# EAGLE schematic PC_PIC (EAGLE 7.7.0)
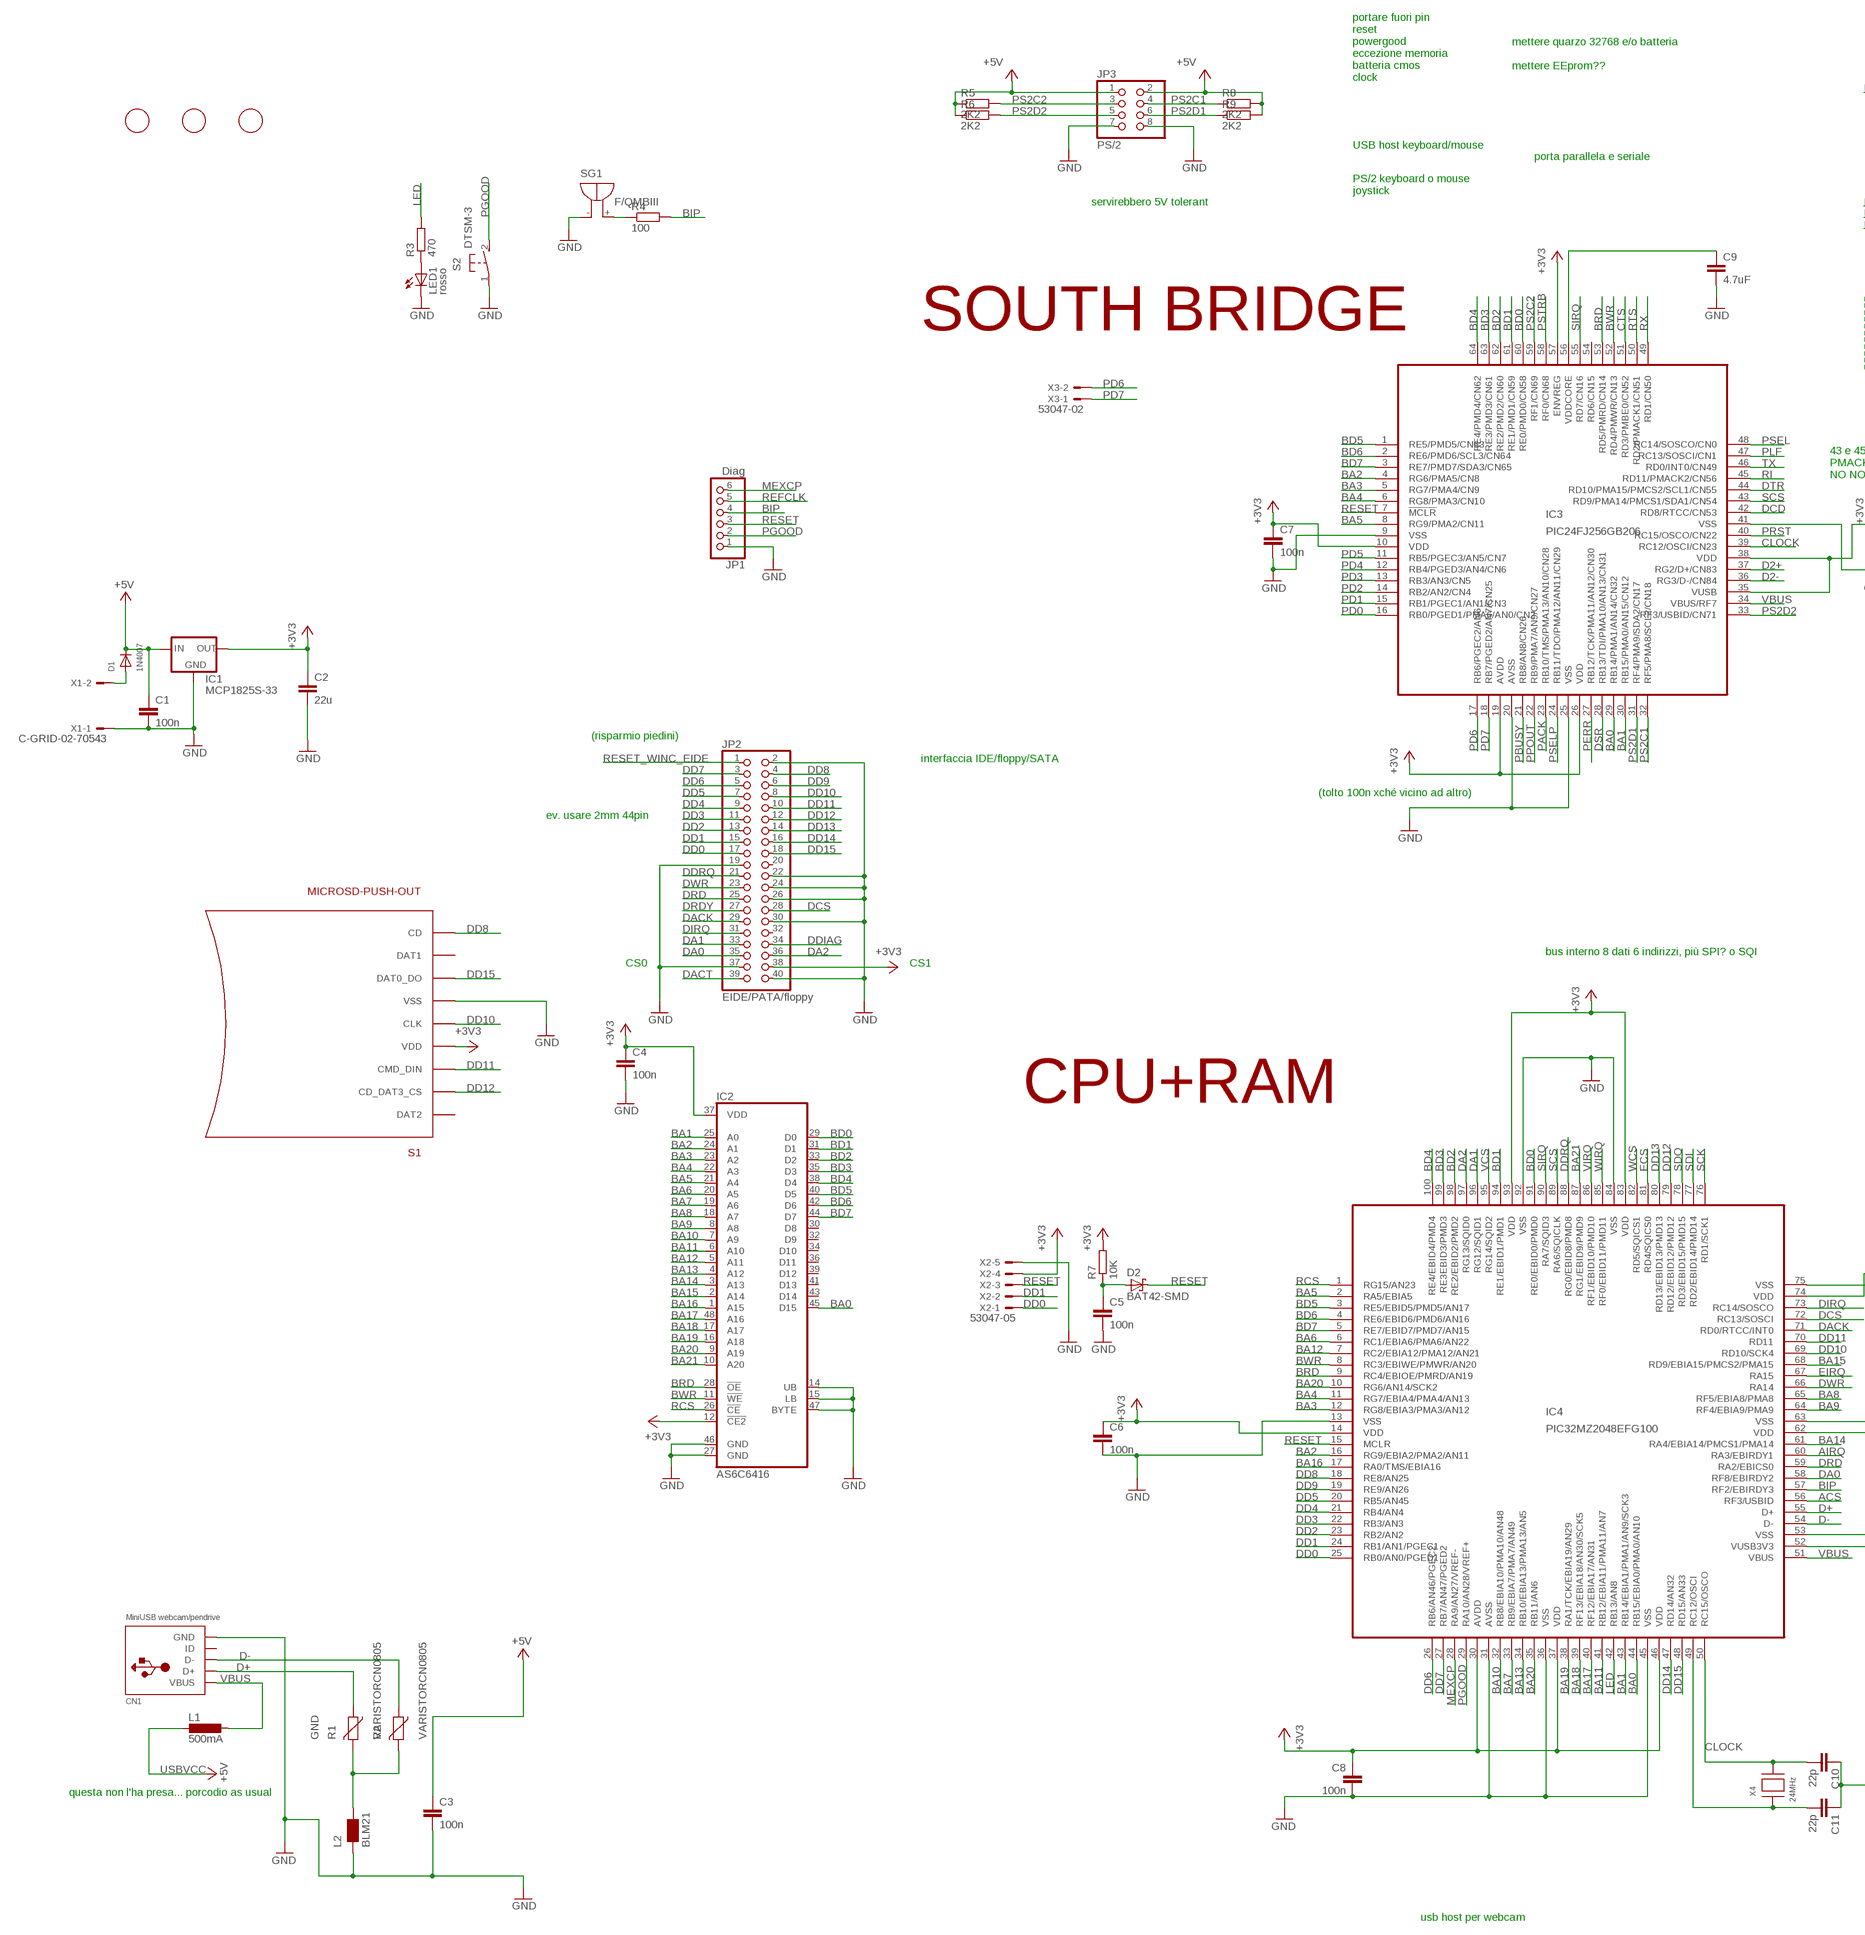
[diagram p0: schematic, sheet 1, part 1 of 3]
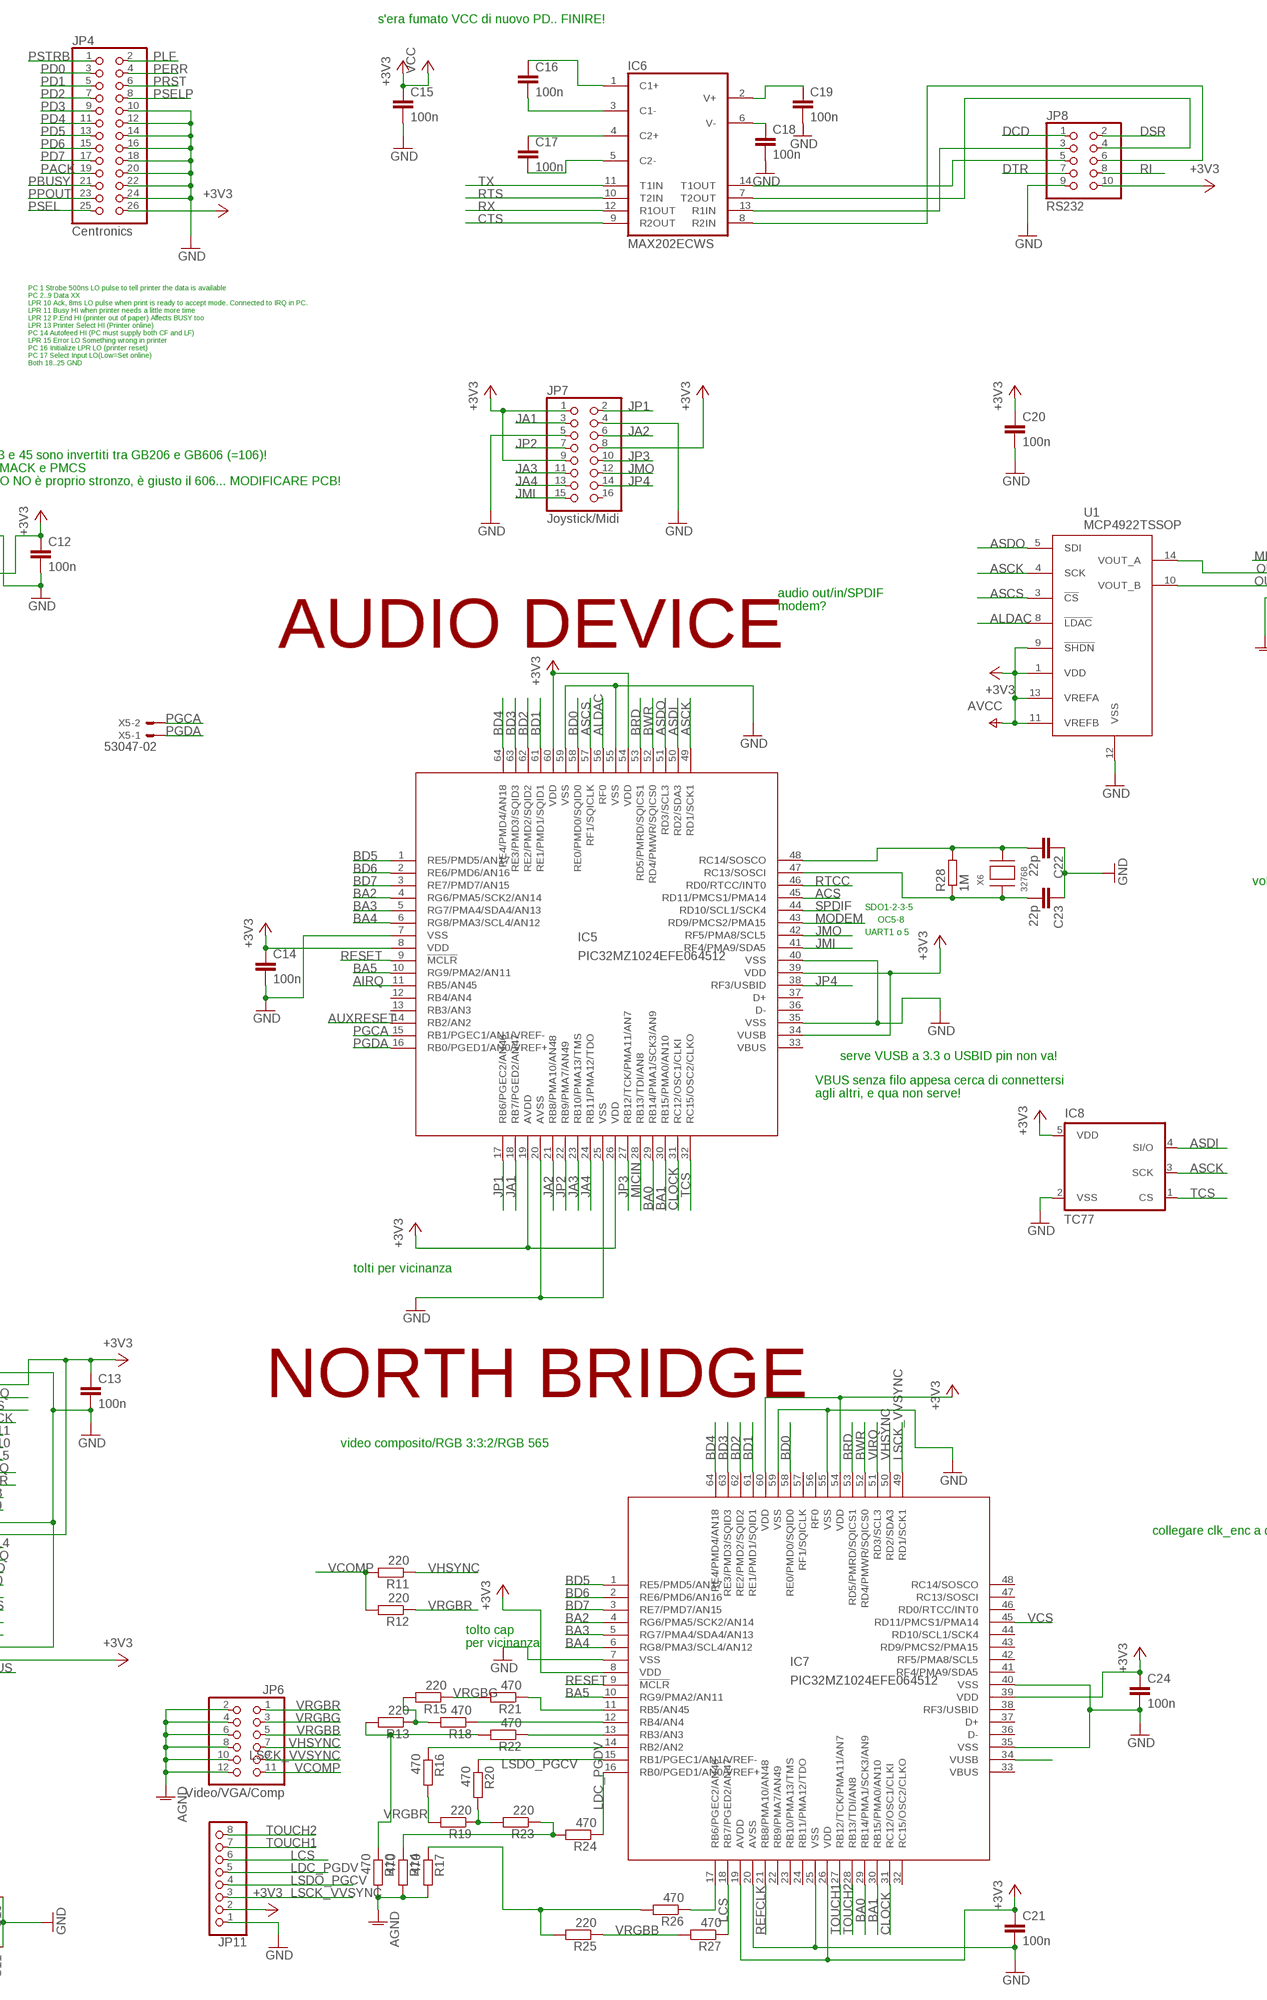
[diagram p1: schematic, sheet 1, part 2 of 3]
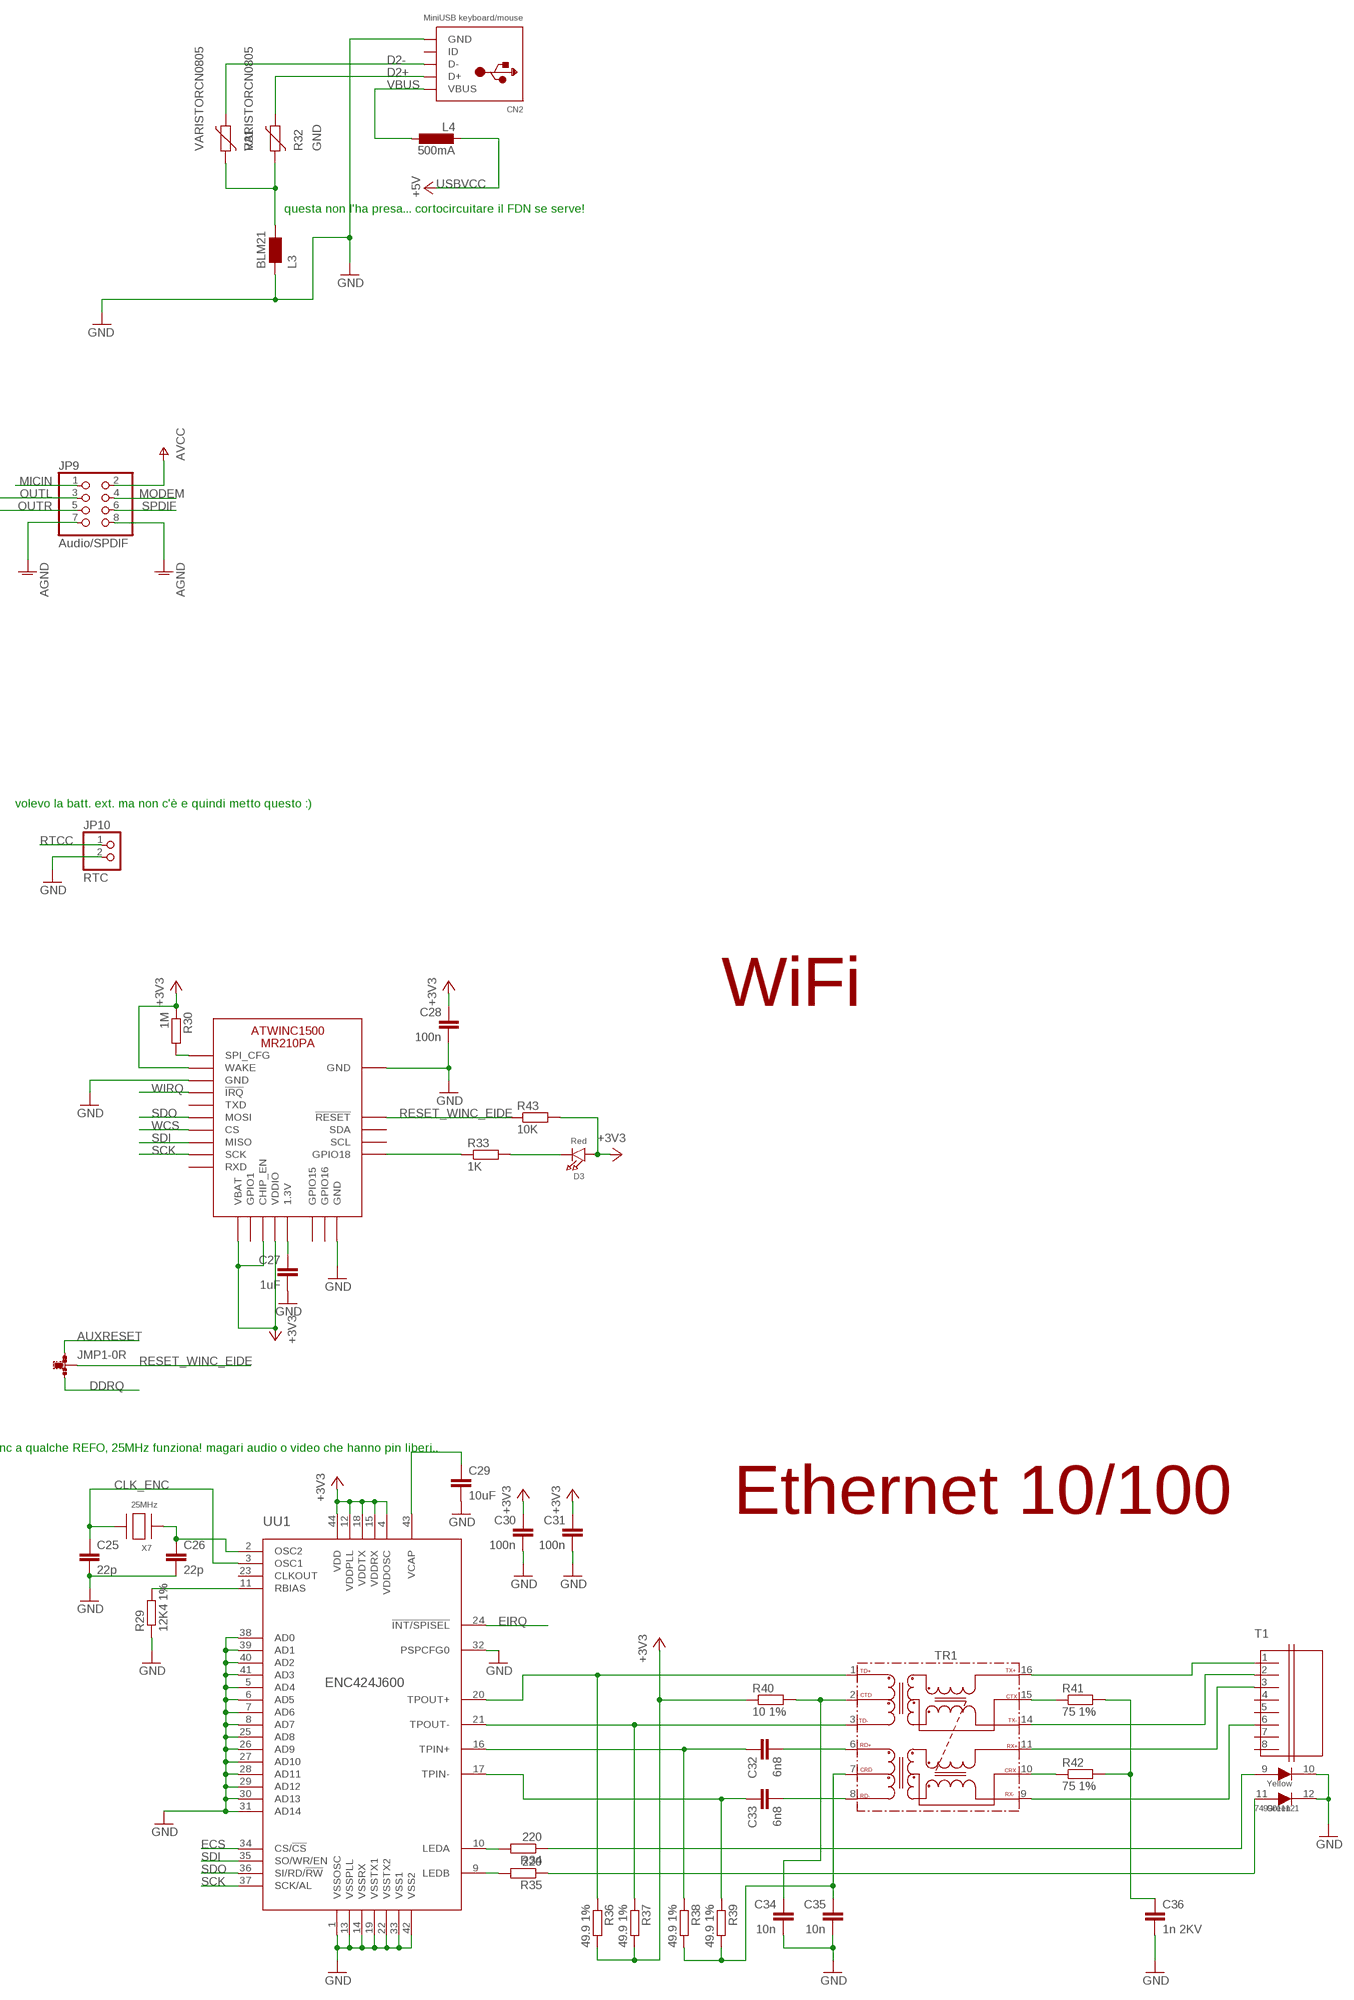
[diagram p2: schematic, sheet 1, part 3 of 3]

## Parts
C1  100n  C-EUC0805  [C0805]
C2  22u  C-EUC1206  [C1206]
C3  100n  C-EUC0805  [C0805]
C4  100n  C-EUC0805  [C0805]
C5  100n  C-EUC0805  [C0805]
C6  100n  C-EUC0805  [C0805]
C7  100n  C-EUC0805  [C0805]
C8  100n  C-EUC0805  [C0805]
C9  4.7uF  C-EUC1206  [C1206]
C10  22p  C-EUC0805  [C0805]
C11  22p  C-EUC0805  [C0805]
C12  100n  C-EUC0805  [C0805]
C13  100n  C-EUC0805  [C0805]
C14  100n  C-EUC0805  [C0805]
C15  100n  C-EUC0805  [C0805]
C16  100n  C-EUC0805  [C0805]
C17  100n  C-EUC0805  [C0805]
C18  100n  C-EUC0805  [C0805]
C19  100n  C-EUC0805  [C0805]
C20  100n  C-EUC0805  [C0805]
C21  100n  C-EUC0805  [C0805]
C22  22p  C-EUC0805  [C0805]
C23  22p  C-EUC0805  [C0805]
C24  100n  C-EUC0805  [C0805]
C25  22p  C-EUC0805  [C0805]
C26  22p  C-EUC0805  [C0805]
C27  1uF  C-EUC0805  [C0805]
C28  100n  C-EUC0805  [C0805]
C29  10uF  C-EUC1206  [C1206]
C30  100n  C-EUC0805  [C0805]
C31  100n  C-EUC0805  [C0805]
C32  6n8  C-EUC0805  [C0805]
C33  6n8  C-EUC0805  [C0805]
C34  10n  C-EUC0805  [C0805]
C35  10n  C-EUC0805  [C0805]
C36  1n 2KV  C-EUC1206  [C1206]
CN1  MiniUSB webcam/pendrive  USBMINIB  [USB-MINIB]
CN2  MiniUSB keyboard/mouse  USBMINIB  [USB-MINIB]
D1  1N4007  DIODESMA  [SMADIODE]
D2  BAT42-SMD  [DO214AC]
D3  Red  LED0805_NOOUTLINE  [CHIPLED_0805_NOOUTLINE]
F1  FIDUCIAL  [FIDUCIAL_1MM]
F2  FIDUCIAL  [FIDUCIAL_1MM]
F3  FIDUCIAL  [FIDUCIAL_1MM]
IC1  MCP1825S-33  MCP1825SSOT223  [SOT223]
IC2  AS6C6416  [TSOP48]
IC3  PIC24FJ256GB206  [TQFP64-10X10]
IC4  PIC32MZ2048EFG100  [TQFP100-14X14]
IC5  PIC32MZ1024EFE064512  [TQFP64-10X10]
IC6  MAX202ECWS  [SO16]
IC7  PIC32MZ1024EFE064512  [TQFP64-10X10]
IC8  TC77  [SOT23-5L]
JMP1  0R-JUMPC  [C0R-JMP]
JP1  Diag  PINHD-1X06_2.54  [1X06]
JP2  EIDE/PATA/floppy  PINHD-2X20_2.54  [2X20]
JP3  PS/2  PINHD-2X04_2.54  [2X04]
JP4  Centronics  PINHD-2X13_2.54  [2X13]
JP6  Video/VGA/Comp  PINHD-2X06_2.54  [2X06]
JP7  Joystick/Midi  PINHD-2X08_2.54  [2X08]
JP8  RS232  PINHD-2X05_2.54  [2X05]
JP9  Audio/SPDIF  PINHD-2X04_2.54  [2X04]
JP10  RTC  PINHD-1X02_2.54  [1X02]
JP11  PINHD-1X08_2.54  [1X08]
L1  500mA  L-EUL1812  [L1812]
L2  BLM21  WE-CBF_0805  [0805]
L3  BLM21  WE-CBF_0805  [0805]
L4  500mA  L-EUL1812  [L1812]
LED1  rosso  LEDCHIPLED_0805  [CHIPLED_0805]
R1  VARISTORCN0805  [CT/CN0805]
R2  VARISTORCN0805  [CT/CN0805]
R3  470  R-EU_R0805  [R0805]
R4  100  R-EU_R0805  [R0805]
R5  2K2  R-EU_R0805  [R0805]
R6  2K2  R-EU_R0805  [R0805]
R7  10K  R-EU_R0805  [R0805]
R8  2K2  R-EU_R0805  [R0805]
R9  2K2  R-EU_R0805  [R0805]
R10  470  R-EU_R0805  [R0805]
R11  220  R-EU_R0805  [R0805]
R12  220  R-EU_R0805  [R0805]
R13  220  R-EU_R0805  [R0805]
R14  470  R-EU_R0805  [R0805]
R15  220  R-EU_R0805  [R0805]
R16  470  R-EU_R0805  [R0805]
R17  470  R-EU_R0805  [R0805]
R18  470  R-EU_R0805  [R0805]
R19  220  R-EU_R0805  [R0805]
R20  470  R-EU_R0805  [R0805]
R21  470  R-EU_R0805  [R0805]
R22  470  R-EU_R0805  [R0805]
R23  220  R-EU_R0805  [R0805]
R24  470  R-EU_R0805  [R0805]
R25  220  R-EU_R0805  [R0805]
R26  470  R-EU_R0805  [R0805]
R27  470  R-EU_R0805  [R0805]
R28  1M  R-EU_R0805  [R0805]
R29  12K4 1%  R-EU_R0805  [R0805]
R30  1M  R-EU_R0805  [R0805]
R31  VARISTORCN0805  [CT/CN0805]
R32  VARISTORCN0805  [CT/CN0805]
R33  1K  R-EU_R0805  [R0805]
R34  220  R-EU_R0805  [R0805]
R35  220  R-EU_R0805  [R0805]
R36  49.9 1%  R-EU_R0805  [R0805]
R37  49.9 1%  R-EU_R0805  [R0805]
R38  49.9 1%  R-EU_R0805  [R0805]
R39  49.9 1%  R-EU_R0805  [R0805]
R40  10 1%  R-EU_R0805  [R0805]
R41  75 1%  R-EU_R0805  [R0805]
R42  75 1%  R-EU_R0805  [R0805]
R43  10K  R-EU_R0805  [R0805]
S1  MICROSD-PUSH-OUT  [MICROSD-PUSH-OUT]
S2  DTSM-3  [DTSM-3]
SG1  F/QMBIII  [F/QMBIII]
T1  7499011121  [01LAN_RJ45_10/00_Y-G_STD]
TR1  WE-LAN-10/100-BASE-T,POE,749013011  [749013011]
U1  MCP4922TSSOP  [TSSOP14]
UU1  ENC424J600  [TQFP-44]
X1  C-GRID-02-70543  [70543-02]
X2  53047-05  [53047-05]
X3  53047-02  [53047-02]
X4  24MHz  XTALNX5032  [NX5032]
X5  53047-02  [53047-02]
X6  32768  XTAL-3.2X1.5  [XTAL3215]
X7  25MHz  XTALNX5032  [NX5032]
X8  ATWINC1500_MR210PB  ATWINC1500_MR210PA  [ATWINC1500_MR210PA]

## Nets
+3V3 [+3V3]: C2.1 C4.1 C6.1 C7.1 C8.1 C12.1 C13.1 C14.1 C15.1 C20.1 C21.1 C24.1 C28.1 C30.1 C31.1 D3.A IC1.3(OUT) IC2.12(!CE2) IC2.37(VDD) IC3.10(VDD) IC3.19(AVDD) IC3.26(VDD) IC3.35(VUSB) IC3.38(VDD) IC3.57(ENVREG) IC4.14(VDD) IC4.30(AVDD) IC4.37(VDD) IC4.46(VDD) IC4.52(VUSB3V3) IC4.62(VDD) IC4.74(VDD) IC4.83(VDD) IC4.93(VDD) IC5.8(VDD) IC5.19(AVDD) IC5.26(VDD) IC5.34(VUSB) IC5.39(VDD) IC5.54(VDD) IC5.60(VDD) IC7.8(VDD) IC7.19(AVDD) IC7.26(VDD) IC7.39(VDD) IC7.54(VDD) IC7.60(VDD) IC8.5(VDD) JP2.38 JP4.26 JP7.1 JP7.8 JP7.9 JP8.10 JP9.2 JP11.2 R7.2 R30.1 R36.2 R37.2 R40.1 R43.2 S1.4(VDD) U1.1(VDD) U1.9(!SHDN) U1.11(VREFB) U1.13(VREFA) UU1.4(VDDOSC) UU1.12(VDDPLL) UU1.15(VDDRX) UU1.18(VDDTX) UU1.44(VDD) X2.4 X8.J11(WAKE) X8.J20(VBAT) X8.J22(CHIP_EN) X8.J23(VDDIO) ; supply symbol labelled AVCC
+5V [+5V]: C1.1 C3.1 D1.C IC1.1(IN) JP3.1 JP3.2 R5.1 R6.1 R8.2 R9.2
ACS: IC4.56(RF3/USBID) IC5.45(RD11/PMCS1/PMA14)
AIRQ: IC4.60(RA3/EBIRDY1) IC5.11(RB5/AN45)
ALDAC: IC5.56(RF0) U1.8(!LDAC)
ASCK: IC5.49(RD1/SCK1) IC8.3(SCK) U1.4(SCK)
ASCS: IC5.57(RF1/SQICLK) U1.3(!CS)
ASDI: IC5.50(RD2/SDA3) IC8.4(SI/O)
ASDO: IC5.51(RD3/SCL3) U1.5(SDI)
AUXRESET: IC5.14(RB2/AN2) JMP1.1
BA0: IC2.45(D15) IC3.29(RB14/PMA1/AN14/CN32) IC4.44(RB15/EBIA0/PMA0/AN10) IC5.29(RB14/PMA1/SCK3/AN9) IC7.29(RB14/PMA1/SCK3/AN9)
BA1: IC2.25(A0) IC3.30(RB15/PMA0/AN15/CN12) IC4.43(RB14/EBIA1/PMA1/AN9/SCK3) IC5.30(RB15/PMA0/AN10) IC7.30(RB15/PMA0/AN10)
BA2: IC2.24(A1) IC3.4(RG6/PMA5/CN8) IC4.16(RG9/EBIA2/PMA2/AN11) IC5.4(RG6/PMA5/SCK2/AN14) IC7.4(RG6/PMA5/SCK2/AN14)
BA3: IC2.23(A2) IC3.5(RG7/PMA4/CN9) IC4.12(RG8/EBIA3/PMA3/AN12) IC5.5(RG7/PMA4/SDA4/AN13) IC7.5(RG7/PMA4/SDA4/AN13)
BA4: IC2.22(A3) IC3.6(RG8/PMA3/CN10) IC4.11(RG7/EBIA4/PMA4/AN13) IC5.6(RG8/PMA3/SCL4/AN12) IC7.6(RG8/PMA3/SCL4/AN12)
BA5: IC2.21(A4) IC3.8(RG9/PMA2/CN11) IC4.2(RA5/EBIA5) IC5.10(RG9/PMA2/AN11) IC7.10(RG9/PMA2/AN11)
BA6: IC2.20(A5) IC4.6(RC1/EBIA6/PMA6/AN22)
BA7: IC2.19(A6) IC4.33(RB9/EBIA7/PMA7/AN49)
BA8: IC2.18(A7) IC4.65(RF5/EBIA8/PMA8)
BA9: IC2.8(A8) IC4.64(RF4/EBIA9/PMA9)
BA10: IC2.7(A9) IC4.32(RB8/EBIA10/PMA10/AN48)
BA11: IC2.6(A10) IC4.41(RB12/EBIA11/PMA11/AN7)
BA12: IC2.5(A11) IC4.7(RC2/EBIA12/PMA12/AN21)
BA13: IC2.4(A12) IC4.34(RB10/EBIA13/PMA13/AN5)
BA14: IC2.3(A13) IC4.61(RA4/EBIA14/PMCS1/PMA14)
BA15: IC2.2(A14) IC4.68(RD9/EBIA15/PMCS2/PMA15)
BA16: IC2.1(A15) IC4.17(RA0/TMS/EBIA16)
BA17: IC2.48(A16) IC4.40(RF12/EBIA17/AN31)
BA18: IC2.17(A17) IC4.39(RF13/EBIA18/AN30/SCK5)
BA19: IC2.16(A18) IC4.38(RA1/TCK/EBIA19/AN29)
BA20: IC2.9(A19) IC4.10(RG6/AN14/SCK2) IC4.35(RB11/AN6)
BA21: IC2.10(A20) IC4.87(RG1/EBID9/PMD9)
BD0: IC2.29(D0) IC3.60(RE0/PMD0/CN58) IC4.91(RE0/EBID0/PMD0) IC5.58(RE0/PMD0/SQID0) IC7.58(RE0/PMD0/SQID0)
BD1: IC2.31(D1) IC3.61(RE1/PMD1/CN59) IC4.94(RE1/EBID1/PMD1) IC5.61(RE1/PMD1/SQID1) IC7.61(RE1/PMD1/SQID1)
BD2: IC2.33(D2) IC3.62(RE2/PMD2/CN60) IC4.98(RE2/EBID2/PMD2) IC5.62(RE2/PMD2/SQID2) IC7.62(RE2/PMD2/SQID2)
BD3: IC2.35(D3) IC3.63(RE3/PMD3/CN61) IC4.99(RE3EBID3/PMD3) IC5.63(RE3/PMD3/SQID3) IC7.63(RE3/PMD3/SQID3)
BD4: IC2.38(D4) IC3.64(RE4/PMD4/CN62) IC4.100(RE4/EBID4/PMD4) IC5.64(RE4/PMD4/AN18) IC7.64(RE4/PMD4/AN18)
BD5: IC2.40(D5) IC3.1(RE5/PMD5/CN63) IC4.3(RE5/EBID5/PMD5/AN17) IC5.1(RE5/PMD5/AN17) IC7.1(RE5/PMD5/AN17)
BD6: IC2.42(D6) IC3.2(RE6/PMD6/SCL3/CN64) IC4.4(RE6/EBID6/PMD6/AN16) IC5.2(RE6/PMD6/AN16) IC7.2(RE6/PMD6/AN16)
BD7: IC2.44(D7) IC3.3(RE7/PMD7/SDA3/CN65) IC4.5(RE7/EBID7/PMD7/AN15) IC5.3(RE7/PMD7/AN15) IC7.3(RE7/PMD7/AN15)
BIP: IC4.57(RF2/EBIRDY3) JP1.4 R4.2
BRD: IC2.28(!OE) IC3.53(RD5/PMRD/CN14) IC4.9(RC4/EBIOE/PMRD/AN19) IC5.53(RD5/PMRD/SQICS1) IC7.53(RD5/PMRD/SQICS1)
BWR: IC2.11(!WE) IC3.52(RD4/PMWR/CN13) IC4.8(RC3/EBIWE/PMWR/AN20) IC5.52(RD4/PMWR/SQICS0) IC7.52(RD4/PMWR/SQICS0)
CLK_ENC: C25.1 UU1.3(OSC1) X7.P$2
CLOCK: C10.2 IC3.39(RC12/OSCI/CN23) IC4.50(RC15/OSCO) IC5.31(RC12/OSC1/CLKI) IC7.31(RC12/OSC1/CLKI) X4.P$2
CTS: IC3.51(RD3/PMBE0/CN52) IC6.9(R2OUT)
D2+: CN2.D+ IC3.37(RG2/D+/CN83) R32.1
D2-: CN2.D- IC3.36(RG3/D-/CN84) R31.1
D+: CN1.D+ IC4.55(D+) R1.1
D-: CN1.D- IC4.54(D-) R2.1
DA0: IC4.58(RF8/EBIRDY2) JP2.35
DA1: IC4.96(RG12/SQID1) JP2.33
DA2: IC4.97(RG13/SQID0) JP2.36
DACK: IC4.71(RD0/RTCC/INT0) JP2.29
DACT: JP2.39
DCD: IC3.42(RD8/RTCC/CN53) JP8.1
DCS: IC4.72(RC13/SOSCI) JP2.28
DD0: IC4.25(RB0/AN0/PGED1) JP2.17 X2.1
DD1: IC4.24(RB1/AN1/PGEC1) JP2.15 X2.2
DD2: IC4.23(RB2/AN2) JP2.13
DD3: IC4.22(RB3/AN3) JP2.11
DD4: IC4.21(RB4/AN4) JP2.9
DD5: IC4.20(RB5/AN45) JP2.7
DD6: IC4.26(RB6/AN46/PGEC2) JP2.5
DD7: IC4.27(RB7/AN47/PGED2) JP2.3
DD8: IC4.18(RE8/AN25) JP2.4 S1.CD
DD9: IC4.19(RE9/AN26) JP2.6
DD10: IC4.69(RD10/SCK4) JP2.8 S1.5(CLK)
DD11: IC4.70(RD11) JP2.10 S1.3(CMD_DIN)
DD12: IC4.79(RD12/EBID12/PMD12) JP2.12 S1.2(CD_DAT3_CS)
DD13: IC4.80(RD13/EBID13/PMD13) JP2.14
DD14: IC4.47(RD14/AN32) JP2.16
DD15: IC4.48(RD15/AN33) JP2.18 S1.7(DAT0_DO)
DDIAG: JP2.34
DDRQ: IC4.88(RG0/EBID8/PMD8) JMP1.3 JP2.21
DIRQ: IC4.73(RC14/SOSCO) JP2.31
DRD: IC4.59(RA2/EBICS0) JP2.25
DRDY: JP2.27
DSR: IC3.28(RB13/TDI/PMA10/AN13/CN31) JP8.2
DTR: IC3.44(RD10/PMA15/PMCS2/SCL1/CN55) JP8.7
DWR: IC4.66(RA14) JP2.23
ECS: IC4.81(RD4/SQICS0) UU1.34(CS/!CS)
EIRQ: IC4.67(RA15) UU1.24(!INT/SPISEL)
GND [GND]: C1.2 C2.2 C3.2 C4.2 C5.2 C6.2 C7.2 C8.2 C9.2 C10.1 C11.1 C12.2 C13.2 C14.2 C15.2 C18.2 C19.2 C20.2 C21.2 C22.1 C23.1 C24.2 C25.2 C26.2 C27.2 C28.2 C29.2 C30.2 C31.2 C34.2 C35.2 C36.2 CN1.GND CN2.GND IC1.2(GND) IC1.4(GND) IC2.14(UB) IC2.15(LB) IC2.27(GND) IC2.46(GND) IC2.47(BYTE) IC3.9(VSS) IC3.20(AVSS) IC3.25(VSS) IC3.41(VSS) IC4.13(VSS) IC4.31(AVSS) IC4.36(VSS) IC4.45(VSS) IC4.53(VSS) IC4.63(VSS) IC4.75(VSS) IC4.84(VSS) IC4.92(VSS) IC5.7(VSS) IC5.20(AVSS) IC5.25(VSS) IC5.35(VSS) IC5.40(VSS) IC5.55(VSS) IC5.59(VSS) IC7.7(VSS) IC7.20(AVSS) IC7.25(VSS) IC7.35(VSS) IC7.40(VSS) IC7.55(VSS) IC7.59(VSS) IC8.2(VSS) JP1.1 JP2.2 JP2.19 JP2.22 JP2.24 JP2.26 JP2.30 JP2.37 JP2.40 JP3.7 JP3.8 JP4.10 JP4.12 JP4.14 JP4.16 JP4.18 JP4.20 JP4.22 JP4.24 JP6.2 JP6.4 JP6.6 JP6.8 JP6.10 JP6.12 JP7.4 JP7.5 JP8.9 JP9.7 JP9.8 JP10.2 JP11.1 L2.1 L3.1 LED1.C R10.2 R14.2 R17.2 R29.1 S1.6(VSS) S1.G1(VSS) S1.G2(VSS) S1.G3(VSS) S1.G4(VSS) S2.1 SG1.-(+) T1.10 T1.12 U1.12(VSS) UU1.1(VSSOSC) UU1.5(AD4) UU1.6(AD5) UU1.7(AD6) UU1.8(AD7) UU1.13(VSSPLL) UU1.14(VSSRX) UU1.19(VSSTX1) UU1.22(VSSTX2) UU1.25(AD8) UU1.26(AD9) UU1.27(AD10) UU1.28(AD11) UU1.29(AD12) UU1.30(AD13) UU1.31(AD14) UU1.32(PSPCFG0) UU1.33(VSS1) UU1.38(AD0) UU1.39(AD1) UU1.40(AD2) UU1.41(AD3) UU1.42(VSS2) X1.1 X2.5 X8.J9(GND) X8.J12(GND) X8.J28(GND) X8.MTGND(GND) ; supply symbol labelled AGND
JA1: IC5.18(RB7/PGED2/AN47) JP7.3
JA2: IC5.21(RB8/PMA10/AN48) JP7.6
JA3: IC5.23(RB10/PMA13/TMS) JP7.11
JA4: IC5.24(RB11/PMA12/TDO) JP7.13
JMI: IC5.41(RF4/PMA9/SDA5) JP7.15
JMO: IC5.42(RF5/PMA8/SCL5) JP7.12
JP1: IC5.17(RB6/PGEC2/AN46) JP7.2
JP2: IC5.22(RB9/PMA7/AN49) JP7.7
JP3: IC5.27(RB12/TCK/PMA11/AN7) JP7.10
JP4: IC5.38(RF3/USBID) JP7.14
LCS: IC7.18(RB7/PGED2/AN47) JP11.6 R27.1
LDC_PGDV: IC7.16(RB0/PGED1/AN0/VREF+) JP11.5 R24.1
LED: IC4.42(RB13/AN8) R3.2
LSCK_VVSYNC: IC7.49(RD1/SCK1) JP6.9 JP11.3
LSDO_PGCV: IC7.15(RB1/PGEC1/AN1/VREF-) JP11.4 R20.1
MEXCP: IC4.28(RA9/AN27/VREF-) JP1.6
MICIN: IC5.28(RB13/TDI/AN8) JP9.1
MODEM: IC5.43(RD9/PMCS2/PMA15) JP9.4
N$1: C32.2 TR1.6(RD+)
N$2: IC7.34(VUSB)
N$3: R36.1 TR1.1(TD+) UU1.20(TPOUT+)
N$4: C16.2 IC6.3(C1-)
N$5: C5.1 D2.A R7.1
N$6 [+5V]: D1.A X1.2
N$7: LED1.A R3.1
N$8: C16.1 IC6.1(C1+)
N$9: R37.1 TR1.3(TD-) UU1.21(TPOUT-)
N$10: R4.1 SG1.+(-)
N$11: C32.1 R38.1 UU1.16(TPIN+)
N$13: IC7.17(RB6/PGEC2/AN46) R26.1
N$14: C34.1 R40.2 TR1.2(CTD)
N$15: C33.1 R39.1 UU1.17(TPIN-)
N$16: C17.1 IC6.4(C2+)
N$17: IC7.14(RB2/AN2) R16.1
N$18: R33.1 X8.J1(GPIO18)
N$19: D3.C R33.2
N$20: IC7.11(RB5/AN45) R21.1
N$21: C11.2 IC4.49(RC12/OSCI) X4.P$1
N$22: C27.1 X8.J24(1.3V)
N$23: R30.2 X8.J10(SPI_CFG)
N$24: C26.1 UU1.2(OSC2) X7.P$1
N$25: IC7.12(RB4/AN4) R18.1
N$26: R29.2 UU1.11(RBIAS)
N$27: C17.2 IC6.5(C2-)
N$28: R35.1 T1.11
N$29: C29.1 UU1.43(VCAP)
N$30: R34.2 UU1.10(LEDA)
N$31: R35.2 UU1.9(LEDB)
N$32: T1.1 TR1.16(TX+)
N$33: T1.2 TR1.14(TX-)
N$34: T1.3 TR1.11(RX+)
N$35: C19.1 IC6.2(V+)
N$36: C18.1 IC6.6(V-)
N$37: T1.6 TR1.9(RX-)
N$38: R34.1 T1.9
N$39: IC6.14(T1OUT) JP8.5
N$40: IC6.7(T2OUT) JP8.4
N$41: C33.2 TR1.8(RD-)
N$42: C35.1 R38.2 R39.2 TR1.7(CRD)
N$43: R41.1 TR1.15(CTX)
N$44: R42.1 TR1.10(CRX)
N$45: C36.1 R41.2 R42.2
N$46: IC6.13(R1IN) JP8.3
N$47: IC6.8(R2IN) JP8.6
N$48: C9.1 IC3.56(VDDCORE)
N$49: IC7.13(RB3/AN3) R22.1
N$51: R17.1 R25.2 R26.2
N$52: R10.1 R13.2 R22.2
N$53: R19.1 R20.2 R23.2
N$55: R14.1 R23.1 R24.2
N$56: R13.1 R15.2 R18.2
OUTL: JP9.3 U1.14(VOUT_A)
OUTR: JP9.5 U1.10(VOUT_B)
PACK: IC3.23(RB10/TMS/PMA13/AN10/CN28) JP4.19
PBUSY: IC3.21(RB8/AN8/CN26) JP4.21
PD0: IC3.16(RB0/PGED1/PMA6/AN0/CN2) JP4.3
PD1: IC3.15(RB1/PGEC1/AN1/CN3) JP4.5
PD2: IC3.14(RB2/AN2/CN4) JP4.7
PD3: IC3.13(RB3/AN3/CN5) JP4.9
PD4: IC3.12(RB4/PGED3/AN4/CN6) JP4.11
PD5: IC3.11(RB5/PGEC3/AN5/CN7) JP4.13
PD6: IC3.17(RB6/PGEC2/AN6) JP4.15 X3.2
PD7: IC3.18(RB7/PGED2/AN7/CN25) JP4.17 X3.1
PERR: IC3.27(RB12/TCK/PMA11/AN12/CN30) JP4.4
PGCA: IC5.15(RB1/PGEC1/AN1/VREF-) X5.2
PGDA: IC5.16(RB0/PGED1/AN0/VREF+) X5.1
PGOOD: IC4.29(RA10/AN28/VREF+) JP1.2 S2.2
PLF: IC3.47(RC13/SOSCI/CN1) JP4.2
PPOUT: IC3.22(RB9/PMA7/AN9/CN27) JP4.23
PRST: IC3.40(RC15/OSCO/CN22) JP4.6
PS2C1: IC3.32(RF5/PMA8/SCL2/CN18) JP3.4 R8.1
PS2C2: IC3.59(RF1/CN69) JP3.3 R5.2
PS2D1: IC3.31(RF4/PMA9/SDA2/CN17) JP3.6 R9.1
PS2D2: IC3.33(RF3/USBID/CN71) JP3.5 R6.2
PSEL: IC3.48(RC14/SOSCO/CN0) JP4.25
PSELP: IC3.24(RB11/TDO/PMA12/AN11/CN29) JP4.8
PSTRB: IC3.58(RF0/CN68) JP4.1
RCS: IC2.26(!CE) IC4.1(RG15/AN23)
REFCLK: IC7.21(RB8/PMA10/AN48) JP1.5
RESET: D2.C IC3.7(!MCLR) IC4.15(MCLR) IC5.9(!MCLR) IC7.9(!MCLR) JP1.3 X2.3
RESET_WINC_EIDE: JMP1.2 JP2.1 R43.1 X8.J4(!RESET)
RI: IC3.45(RD11/PMACK2/CN56) JP8.8
RTCC: IC5.46(RD0/RTCC/INT0) JP10.1
RTS: IC3.50(RD2/PMACK1/CN51) IC6.10(T2IN)
RX: IC3.49(RD1/CN50) IC6.12(R1OUT)
SCK: IC4.76(RD1/SCK1) UU1.37(SCK/AL) X8.J18(SCK)
SCS: IC3.43(RD9/PMA14/PMCS1/SDA1/CN54) IC4.89(RA6/SQICLK)
SDI: IC4.77(RD2/EBID14/PMD14) UU1.35(SO/WR/EN) X8.J17(MISO)
SDO: IC4.78(RD3/EBID15/PMD15) UU1.36(SI/RD/!RW) X8.J15(MOSI)
SIRQ: IC3.55(RD7/CN16) IC4.90(RA7/SQID3)
SOSCI: C23.2 IC5.47(RC13/SOSCI) R28.1 X6.P$1
SOSCO: C22.2 IC5.48(RC14/SOSCO) R28.2 X6.P$2
SPDIF: IC5.44(RD10/SCL1/SCK4) JP9.6
TCS: IC5.32(RC15/OSC2/CLKO) IC8.1(CS)
TOUCH1: IC7.27(RB12/TCK/PMA11/AN7) JP11.7
TOUCH2: IC7.28(RB13/TDI/AN8) JP11.8
TX: IC3.46(RD0/INT0/CN49) IC6.11(T1IN)
USBVCC [USBVCC]: L1.2 L4.2 ; supply symbol labelled +5V
USHIELD: L2.2 R1.2 R2.2
USHIELD1: L3.2 R31.2 R32.2
VBUS: CN1.VBUS CN2.VBUS IC3.34(VBUS/RF7) IC4.51(VBUS) L1.1 L4.1
VCOMP: JP6.11 R11.2 R12.2
VCS: IC4.95(RG14/SQID2) IC7.45(RD11/PMCS1/PMA14)
VHSYNC: IC7.50(RD2/SDA3) JP6.7 R11.1
VIRQ: IC4.86(RF1/EBID10/PMD10) IC7.51(RD3/SCL3)
VRGBB: JP6.5 R25.1 R27.2
VRGBG: JP6.3 R15.1 R21.2
VRGBR: JP6.1 R12.1 R16.2 R19.2
WCS: IC4.82(RD5/SQICS1) X8.J16(CS)
WIRQ: IC4.85(RF0/EBID11/PMD11) X8.J13(!IRQ)
Unconnected: CN1.ID CN2.ID IC2.30(D8) IC2.32(D9) IC2.34(D10) IC2.36(D11) IC2.39(D12) IC2.41(D13) IC2.43(D14) IC3.54(RD6/CN15) IC5.12(RB4/AN4) IC5.13(RB3/AN3) IC5.33(VBUS) IC5.36(D-) IC5.37(D+) IC7.22(RB9/PMA7/AN49) IC7.23(RB10/PMA13/TMS) IC7.24(RB11/PMA12/TDO) IC7.32(RC15/OSC2/CLKO) IC7.33(VBUS) IC7.36(D-) IC7.37(D+) IC7.38(RF3/USBID) IC7.41(RF4/PMA9/SDA5) IC7.42(RF5/PMA8/SCL5) IC7.43(RD9/PMCS2/PMA15) IC7.44(RD10/SCL1/SCK4) IC7.46(RD0/RTCC/INT0) IC7.47(RC13/SOSCI) IC7.48(RC14/SOSCO) IC7.56(RF0) IC7.57(RF1/SQICLK) JP2.20 JP2.32 JP7.16 S1.1(DAT2) S1.8(DAT1) T1.4 T1.5 T1.7 T1.8 TR1.4(NC) TR1.5(NC) TR1.12(NC) TR1.13(NC) UU1.23(CLKOUT) X8.J2(SCL) X8.J3(SDA) X8.J14(TXD) X8.J19(RXD) X8.J21(GPIO1) X8.J26(GPIO15) X8.J27(GPIO16)

## Notes on the sheet
- s'era fumato VCC di nuovo PD.. FINIRE!
- mettere quarzo 32768 e/o batteria
  
  mettere EEprom??
- portare fuori pin
  reset
  powergood
  eccezione memoria
  batteria cmos
  clock
- USB host keyboard/mouse
- porta parallela e seriale
- PS/2 keyboard o mouse
  joystick
- servirebbero 5V tolerant
- questa non l'ha presa... cortocircuitare il FDN se serve!
- SOUTH BRIDGE
- PC 1 Strobe 500ns LO pulse to tell printer the data is available 
  PC 2..9 Data XX 
  LPR 10 Ack, 8ms LO pulse when print is ready to accept mode. Connected to IRQ in PC. 
  LPR 11 Busy HI when printer needs a little more time 
  LPR 12 P.End HI (printer out of paper) Affects BUSY too 
  LPR 13 Printer Select HI (Printer online) 
  PC 14 Autofeed HI (PC must supply both CF and LF) 
  LPR 15 Error LO Something wrong in printer 
  PC 16 Initialize LPR LO (printer reset) 
  PC 17 Select Input LO(Low=Set online) 
  Both 18..25 GND
- 43 e 45 sono invertiti tra GB206 e GB606 (=106)!
  PMACK e PMCS
  NO NO è proprio stronzo, è giusto il 606... MODIFICARE PCB!
- audio out/in/SPDIF
  modem?
- AUDIO DEVICE
- (risparmio piedini)
- interfaccia IDE/floppy/SATA
- (tolto 100n xché vicino ad altro)
- ev. usare 2mm 44pin
- volevo la batt. ext. ma non c'è e quindi metto questo :)
- SDO1-2-3-5
- OC5-8
- UART1 o 5
- bus interno 8 dati 6 indirizzi, più SPI? o SQI
- CS0 | CS1
- serve VUSB a 3.3 o USBID pin non va!
- WiFi
- VBUS senza filo appesa cerca di connettersi 
  agli altri, e qua non serve!
- CPU+RAM
- tolti per vicinanza
- NORTH BRIDGE
- video composito/RGB 3:3:2/RGB 565
- collegare clk_enc a qualche REFO, 25MHz funziona! magari audio o video che hanno pin liberi..
- Ethernet 10/100
- tolto cap 
  per vicinanza
- questa non l'ha presa... porcodio as usual
- usb host per webcam

## Power pins joined to a net without a drawn wire
GND: IC6.15(GND)
VCC: IC6.16(VCC)

## Library data of the parts
C1-C36 = resistor:C-EU: CAPACITOR, European symbol
CN1 CN2 = adafruit:USB: USB Connectors USBMINIB - Surface Mount Female Mini-B USB Connector 4UConnector: 06564 By microbuilder.eu Thru-hole RA Female Mini-B USB Connector 4UConnector: 18732 By ladyada.net
D1 = adafruit:DIODE: Diode SMADIODE - SMA Surface Mount Package 20V 1A Schottky Diode Digikey: 641-1014-6-ND DO-1N4148 - Through Hole Small Current Diode SOD-123 20V 1 A (.5mV Vf) Schottky Diode - Digikey: MBRX120TPMSCT-ND SOD-323 10V 570mA (.38mV Vf, 3ns) Schottky Diode - Digikey: ZLLS410CT-ND SOD-523 30V 30mA Schottky Diode (RB751S-40TE61) - Digikey: RB751S-40TE61CT-ND SOT23-R/W - SOT23 Package (R = Solder Paste/Reflow Ovens, W = Hand-Soldering) BAT54Film 40V 300mA - Digikey: 497-7162-1-ND
D2 = diode:BAT42-SMD: DIODE barrier diode
D3 = microbuilder:LED: LED
F1-F3 = adafruit:FIDUCIAL: For use by pick and place machines to calibrate the vision/machine, 1mm By microbuilder.eu
IC1 = microchip2:MCP1825S: VOLTAGE REGULATOR
IC2 = memory:AS6C6416: 64 Mbit (4x16) Static RAM Source: https://www.alliancememory.com/datasheets/as6c6416/
IC3 = microchip2:PIC24FJ256GB206: PIC24FJ256GB106 edit this description Auto generated by make-symbol-device-package-bsdl.ulp Rev. 25 Source: PIC24FJ256GB106.bsd; MPN: PIC24FJ256GB106-I/PT; OC_FARNELL: 1576868; OC_NEWARK: 54M5129
IC4 = microchip2:PIC32MZ2048EFG100: PIC32MZ2048EFG100 edit this description Auto generated by make-symbol-device-package-bsdl.ulp Rev. 25 Source: PIC32MZ2048EFG100.bsd; MPN: PIC24FJ256GB110-I/PF; OC_FARNELL: 1576870; OC_NEWARK: 54M5133
IC5 IC7 = microchip2:PIC32MZ1024EFE064: PIC32MX340FxxxH Source: http://ww1.microchip.com/downloads/en/DeviceDoc/61143E.pdf, PIC32MZ1024EFE064.bsdl; MPN: PIC32MX340F512H-80I/PT; OC_FARNELL: 1677915; OC_NEWARK: 98M1931
IC6 = maxim:MAX202ECWS: RS232 TRANSCEIVER
IC8 = microchip2:TC77: Thermometer SPI
JMP1 = jump-0r-smd:0R-JUMP: SMD 0R 0805 Jumper
JP1 = pinhead-2:PINHD-1X06: PIN HEADER
JP2 = pinhead-2:PINHD-2X20: PIN HEADER
JP3 JP9 = pinhead-2:PINHD-2X04: PIN HEADER
JP4 = pinhead-2:PINHD-2X13: PIN HEADER
JP6 = pinhead-2:PINHD-2X06: PIN HEADER
JP7 = pinhead-2:PINHD-2X08: PIN HEADER
JP8 = pinhead-2:PINHD-2X05: PIN HEADER
JP10 = pinhead-2:PINHD-1X02: PIN HEADER
JP11 = pinhead-2:PINHD-1X08: PIN HEADER
L1 L4 = rcl:L-EU: INDUCTOR, European symbol
L2 L3 = wuerth-elektronik:WE-CBF: SMD EMI Suppression Ferrite Beads - excellent anti-EMI properties - low DCR - impedances till 3000 ohms - rated current up to 6 A
LED1 = led:LED: LED
R1 R2 R31 R32 = varistor:VARISTOR: VARISTOR
R3-R30 R33-R43 = resistor:R-EU_: RESISTOR, European symbol
S1 = microsd:MICROSD-PUSH-OUT: T-Flash Push-Out Micro SD Card Reader 14.75mm x 14.5mm SMD with external pins
S2 = switch-tact:DTSM-3
SG1 = buzzer:F/QMBIII: BUZZER Source: Buerklin; OC_FARNELL: unknown; OC_NEWARK: unknown
T1 = wurth_electronics_midcom_inc_v1-0:7499011121: Package Style: RJ45 10/100 STD Mounting: THT LED: Y-G Shield: 293-0533 Header: 183-0132 Windings Primary: Aux: Secondary: Best pinouts for production vary per application. Please contact Wurth Electronics Midcom, Inc. for assistance with your custom design. Datasheet: 7499011121 <http://katalog.we-online.de/kataloge/eisos/media/pdf/7499011121A.pdf> Website: Wurth Electronics Midcom <http://www.we-online.com/midcom> Contact us Wurth Electronics Midcom, Inc. 121 Airport Dr. Watertown, SD 57201 Phone: (605) 886-4385 Fax: (605) 886-4486 E-Mail: midcom@we-online.com
TR1 = trafo:WE-LAN-10/100-BASE-T,POE,749013011: LAN-Transformer WE-LAN 10/100 Base Tx - Compliant with IEEE 802.3 standards - SMD -- Ethernet -- Power over Ethernet -- 1 Gigabit Ethernet -- Compliant with most IC's for ethernet applications like Intel, AMD, Globespan and Realtek -- Hub, Router, Switch <http://katalog.we-online.de/media/images/eisos/UtLAN_pf2.jpg> Details see: http://katalog.we-online.de/en/pbs/WE-LAN/S/749013011? Updated by Dan Xu 2014-07-08 2014 (C) Würth Elektronik; COMPANY-URL: http://www.we-online.de; CREATED-BY: Christin Zierenner; CREATED-DATE: June 2012; DATASHEET-URL: http://katalog.we-online.de/kataloge/eisos/media/pdf/749013011.pdf; MANUFACTURER: Würth Elektronik eiSos GmbH
U1 = microchip2:MCP4922: MCP4922 - 12bit DAC, SPI interface Datasheet: http://ww1.microchip.com/downloads/en/DeviceDoc/22250A.pdf
UU1 = microchip2:ENC424J600: MICROCHIP ENC424J600 Stand-Alone 10/100 Ethernet Controller with SPI or Parallel Interface
X1 = con-molex:C-GRID-02: CONNECTOR wire to board 2.54 mm (0.100") pitch header; OC_FARNELL: unknown; OC_NEWARK: unknown
X2 = con-molex:53?-05: CONNECTOR wire to board 1.25 mm (.049 inch) pitch header; MF: MOLEX; MPN: 53047-0510; OC_FARNELL: 9732861; OC_NEWARK: 38C9901
X3 X5 = con-molex:53?-02: CONNECTOR wire to board 1.25 mm (.049 inch) pitch header; MF: MOLEX; MPN: 53047-0210; OC_FARNELL: 9733051; OC_NEWARK: 57H4701
X4 X6 X7 = adafruit:XTAL: Low cost SMT crystals, no capacitors included http://www.ladyada.net/library/eagle
X8 = microbuilder:ATWINC1500_MR210PA: ATWINC1500_MR210PA wifi module

## Net classes
1 +3V3: width 0.305 mm, clearance 0.152 mm
2 VBUS: width 0.305 mm, clearance 0.152 mm
4 GND: width 0.305 mm, clearance 0.152 mm
5 +5V: width 0.305 mm, clearance 0.152 mm
6 USBVCC: width 0.305 mm, clearance 0.152 mm